# Altium schematic sheet HIVE_SIGHT_NUCLEO.SchDoc
size Tabloid; Sheet_Name: Insert name in Document Parameters; Size: 11x17
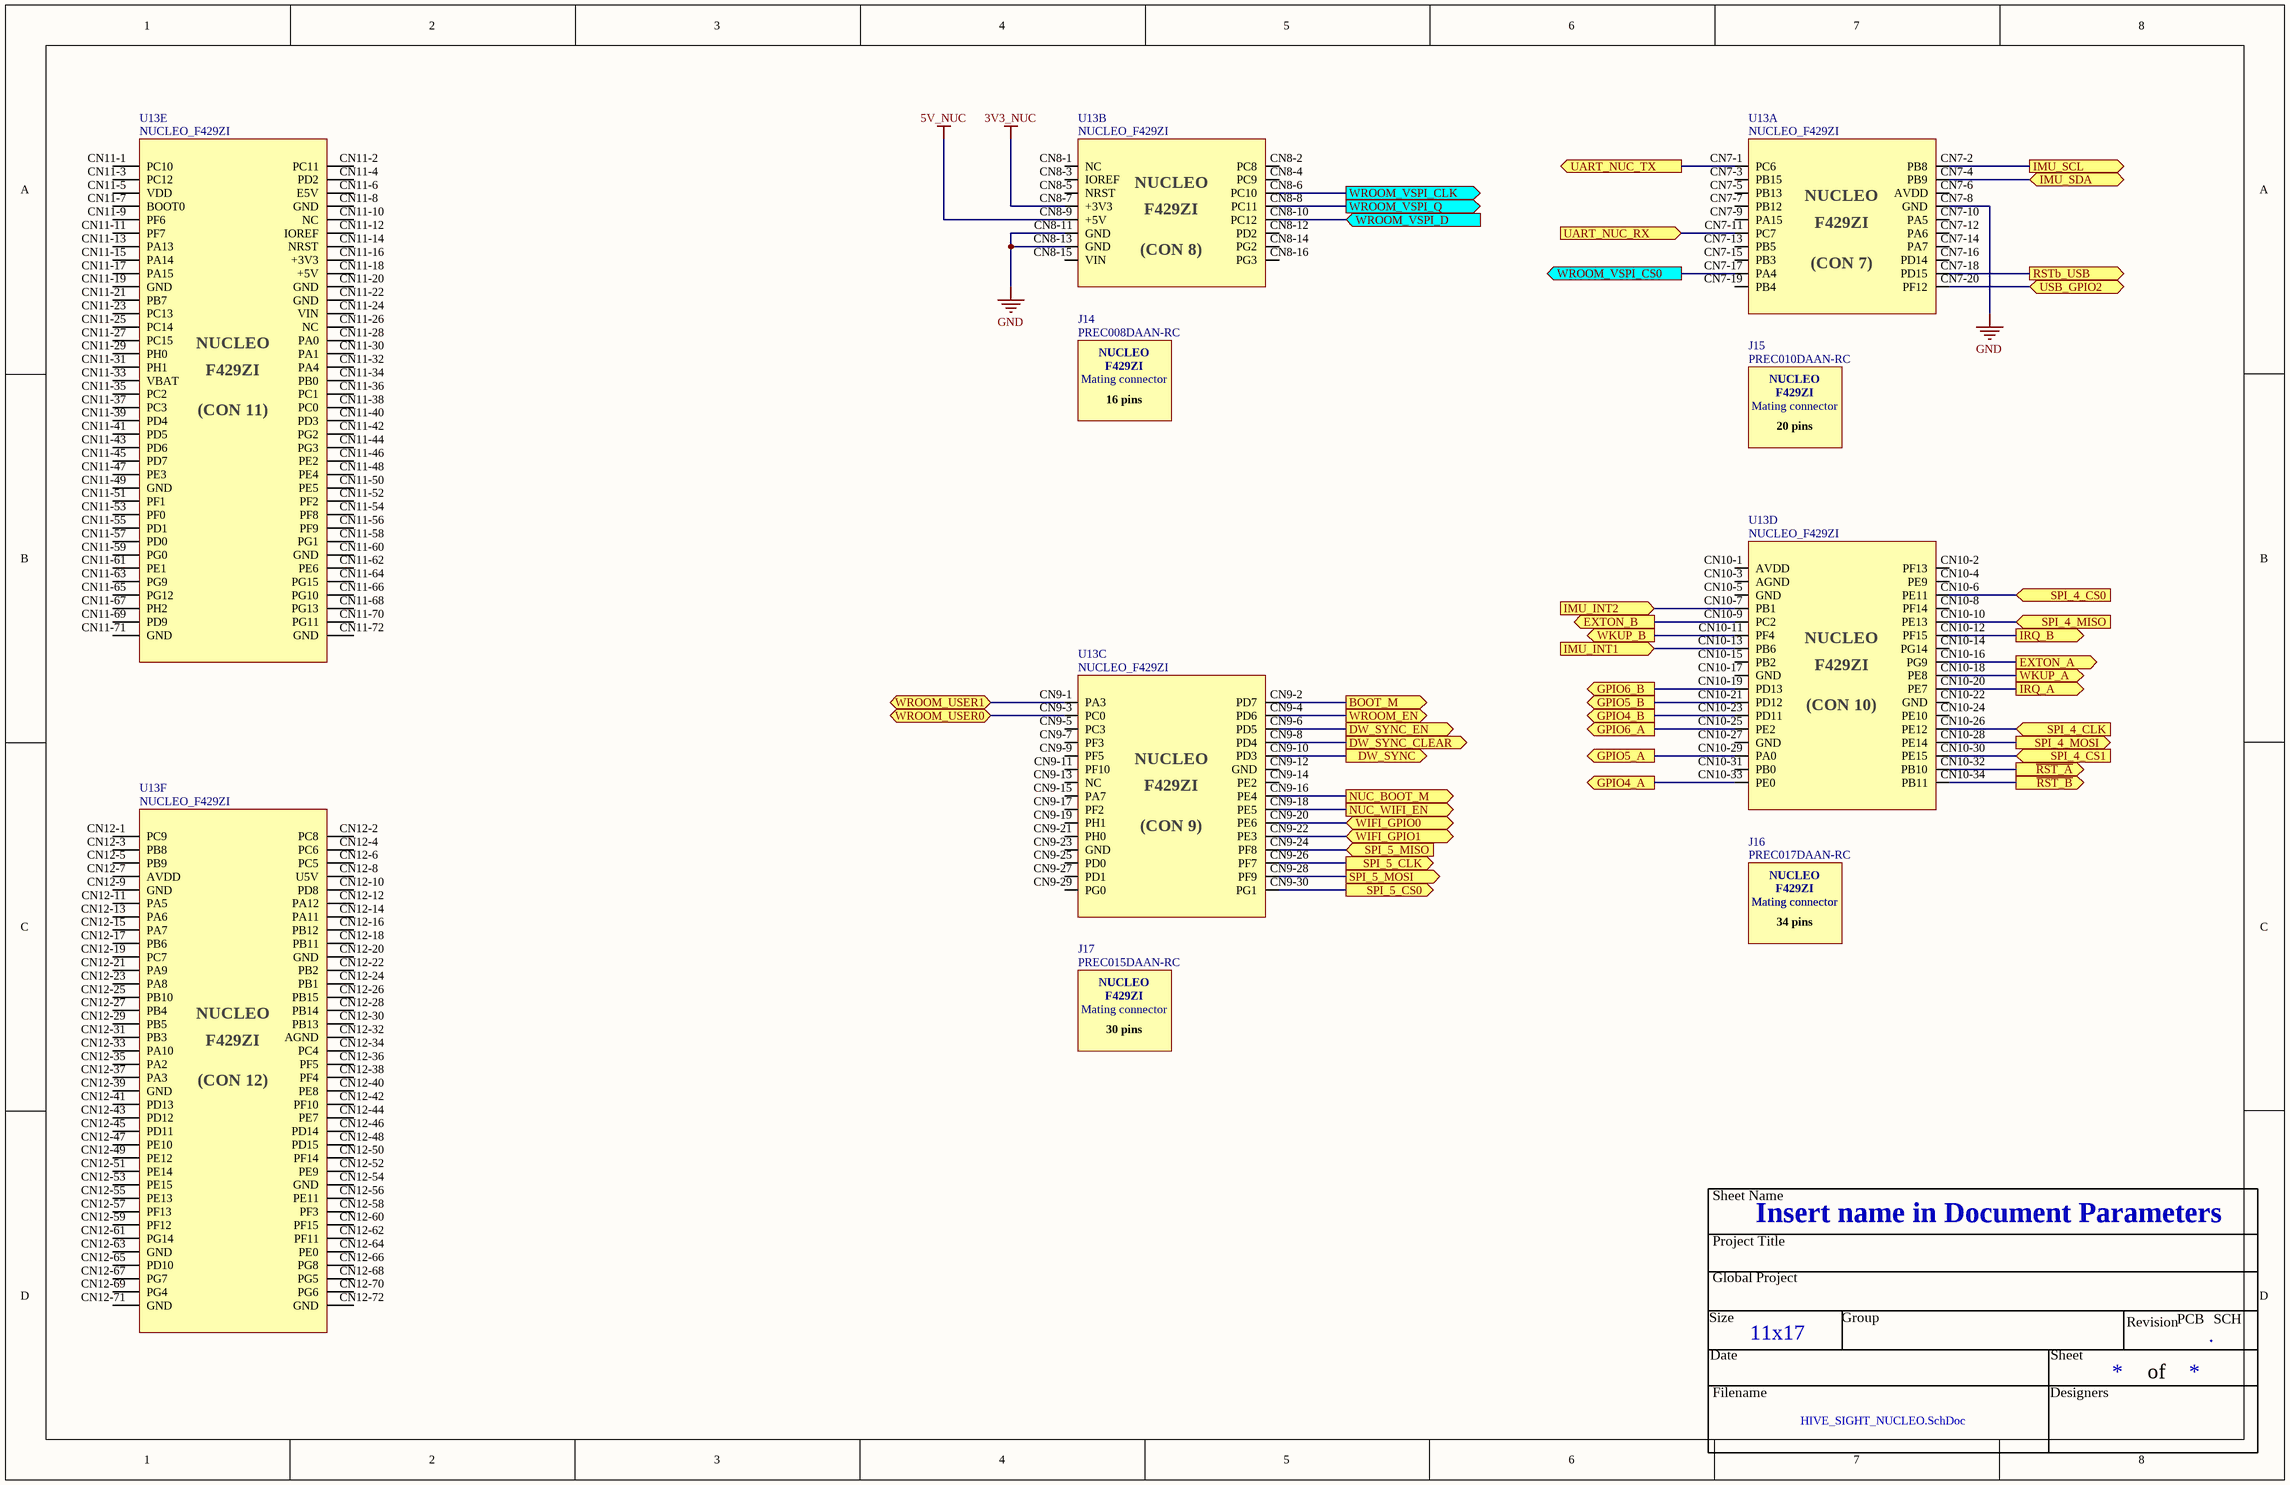
[diagram p0: HIVE_SIGHT_NUCLEO.SchDoc]

## Parts
J14  PREC008DAAN-RC  [CON_HDR_NUCLEO_F429ZI_C008DAAN-RC]
J15  PREC010DAAN-RC  [CON_HDR_NUCLEO_F429ZI_C010DAAN-RC]
J16  PREC017DAAN-RC  [CON_HDR_NUCLEO_F429ZI_C017DAAN-RC]
J17  PREC015DAAN-RC  [CON_HDR_NUCLEO_F429ZI_C015DAAN-RC]
U13  NUCLEO_F429ZI  [MOD_NUCLEO-F429ZI]  (parts A,B,C,D,E,F of 6)

## Ports
BOOT_M (out), DW_SYNC (out), DW_SYNC_CLEAR (out), DW_SYNC_EN (out), EXTON_A (out), EXTON_B (out), GPIO4_A (out), GPIO4_B (out), GPIO5_A (out), GPIO5_B (out), GPIO6_A (out), GPIO6_B (out), IMU_INT1 (in), IMU_INT2 (in), IMU_SCL (out), IMU_SDA (bidir), IRQ_A (out), IRQ_B (out), NUC_BOOT_M (out), NUC_WIFI_EN (out), RSTb_USB (out), SPI_4_CLK (in), SPI_4_CS0 (in), SPI_4_CS1 (in), SPI_4_MISO (in), SPI_4_MOSI (out), SPI_5_CLK (out), SPI_5_CS0 (out), SPI_5_MISO (in), SPI_5_MOSI (out), UART_NUC_RX (in), UART_NUC_TX (out), USB_GPIO2 (bidir), WIFI_GPIO0 (bidir), WIFI_GPIO1 (bidir), WKUP_A (out), WKUP_B (out), WROOM_EN (out), WROOM_USER0 (bidir), WROOM_USER1 (bidir), WROOM_VSPI_CLK (out), WROOM_VSPI_CS0 (out), WROOM_VSPI_D (in), WROOM_VSPI_Q (out), ~{RST_A} (out), ~{RST_B} (out)

## Nets
3V3_NUC: U13.CN8-7(+3V3)
5V_NUC: U13.CN8-9(+5V)
GND: U13.CN7-8(GND) U13.CN8-11(GND) U13.CN8-13(GND)
~{RST_A}: U13.CN10-32(PB10) ; port ~{RST_A}
~{RST_B}: U13.CN10-34(PB11) ; port ~{RST_B}
BOOT_M: U13.CN9-2(PD7) ; port BOOT_M
DW_SYNC: U13.CN9-10(PD3) ; port DW_SYNC
DW_SYNC_CLEAR: U13.CN9-8(PD4) ; port DW_SYNC_CLEAR
DW_SYNC_EN: U13.CN9-6(PD5) ; port DW_SYNC_EN
EXTON_A: U13.CN10-16(PG9) ; port EXTON_A
EXTON_B: U13.CN10-9(PC2) ; port EXTON_B
GPIO4_A: U13.CN10-33(PE0) ; port GPIO4_A
GPIO4_B: U13.CN10-23(PD11) ; port GPIO4_B
GPIO5_A: U13.CN10-29(PA0) ; port GPIO5_A
GPIO5_B: U13.CN10-21(PD12) ; port GPIO5_B
GPIO6_A: U13.CN10-25(PE2) ; port GPIO6_A
GPIO6_B: U13.CN10-19(PD13) ; port GPIO6_B
IMU_INT1: U13.CN10-13(PB6) ; port IMU_INT1
IMU_INT2: U13.CN10-7(PB1) ; port IMU_INT2
IMU_SCL: U13.CN7-2(PB8) ; port IMU_SCL
IMU_SDA: U13.CN7-4(PB9) ; port IMU_SDA
IRQ_A: U13.CN10-20(PE7) ; port IRQ_A
IRQ_B: U13.CN10-12(PF15) ; port IRQ_B
NUC_BOOT_M: U13.CN9-16(PE4) ; port NUC_BOOT_M
NUC_WIFI_EN: U13.CN9-18(PE5) ; port NUC_WIFI_EN
RSTb_USB: U13.CN7-18(PD15) ; port RSTb_USB
SPI_4_CLK: U13.CN10-26(PE12) ; port SPI_4_CLK
SPI_4_CS0: U13.CN10-6(PE11) ; port SPI_4_CS0
SPI_4_CS1: U13.CN10-30(PE15) ; port SPI_4_CS1
SPI_4_MISO: U13.CN10-10(PE13) ; port SPI_4_MISO
SPI_4_MOSI: U13.CN10-28(PE14) ; port SPI_4_MOSI
SPI_5_CLK: U13.CN9-26(PF7) ; port SPI_5_CLK
SPI_5_CS0: U13.CN9-30(PG1) ; port SPI_5_CS0
SPI_5_MISO: U13.CN9-24(PF8) ; port SPI_5_MISO
SPI_5_MOSI: U13.CN9-28(PF9) ; port SPI_5_MOSI
UART_NUC_RX: U13.CN7-11(PC7) ; port UART_NUC_RX
UART_NUC_TX: U13.CN7-1(PC6) ; port UART_NUC_TX
USB_GPIO2: U13.CN7-20(PF12) ; port USB_GPIO2
WIFI_GPIO0: U13.CN9-20(PE6) ; port WIFI_GPIO0
WIFI_GPIO1: U13.CN9-22(PE3) ; port WIFI_GPIO1
WKUP_A: U13.CN10-18(PE8) ; port WKUP_A
WKUP_B: U13.CN10-11(PF4) ; port WKUP_B
WROOM_EN: U13.CN9-4(PD6) ; port WROOM_EN
WROOM_USER0: U13.CN9-3(PC0) ; port WROOM_USER0
WROOM_USER1: U13.CN9-1(PA3) ; port WROOM_USER1
WROOM_VSPI_CLK: U13.CN8-6(PC10) ; port WROOM_VSPI_CLK
WROOM_VSPI_CS0: U13.CN7-17(PA4) ; port WROOM_VSPI_CS0
WROOM_VSPI_D: U13.CN8-10(PC12) ; port WROOM_VSPI_D
WROOM_VSPI_Q: U13.CN8-8(PC11) ; port WROOM_VSPI_Q

Not connected (* = marked no-connect by the designer): U13 CN7-3(PB15) CN7-5(PB13) CN7-6(AVDD) CN7-7(PB12) CN7-9(PA15) CN7-10(PA5) CN7-12(PA6) CN7-13(PB5) CN7-14(PA7) CN7-15(PB3) CN7-16(PD14) CN7-19(PB4) CN8-1(NC) CN8-2(PC8) CN8-3(IOREF) CN8-4(PC9) CN8-5(NRST) CN8-12(PD2) CN8-14(PG2) CN8-15(VIN) CN8-16(PG3) CN9-5(PC3) CN9-7(PF3) CN9-9(PF5) CN9-11(PF10) CN9-12(GND) CN9-13(NC) CN9-14(PE2) CN9-15(PA7) CN9-17(PF2) CN9-19(PH1) CN9-21(PH0) CN9-23(GND) CN9-25(PD0) CN9-27(PD1) CN9-29(PG0) CN10-1(AVDD) CN10-2(PF13) CN10-3(AGND) CN10-4(PE9) CN10-5(GND) CN10-8(PF14) CN10-14(PG14) CN10-15(PB2) CN10-17(GND) CN10-22(GND) CN10-24(PE10) CN10-27(GND) CN10-31(PB0) CN11-1(PC10) CN11-2(PC11) CN11-3(PC12) CN11-4(PD2) CN11-5(VDD) CN11-6(E5V) CN11-7(BOOT0) CN11-8(GND) CN11-9(PF6) CN11-10(NC) CN11-11(PF7) CN11-12(IOREF) CN11-13(PA13) CN11-14(NRST) CN11-15(PA14) CN11-16(+3V3) CN11-17(PA15) CN11-18(+5V) CN11-19(GND) CN11-20(GND) CN11-21(PB7) CN11-22(GND) CN11-23(PC13) CN11-24(VIN) CN11-25(PC14) CN11-26(NC) CN11-27(PC15) CN11-28(PA0) CN11-29(PH0) CN11-30(PA1) CN11-31(PH1) CN11-32(PA4) CN11-33(VBAT) CN11-34(PB0) CN11-35(PC2) CN11-36(PC1) CN11-37(PC3) CN11-38(PC0) CN11-39(PD4) CN11-40(PD3) CN11-41(PD5) CN11-42(PG2) CN11-43(PD6) CN11-44(PG3) CN11-45(PD7) CN11-46(PE2) CN11-47(PE3) CN11-48(PE4) CN11-49(GND) CN11-50(PE5) CN11-51(PF1) CN11-52(PF2) CN11-53(PF0) CN11-54(PF8) CN11-55(PD1) CN11-56(PF9) CN11-57(PD0) CN11-58(PG1) CN11-59(PG0) CN11-60(GND) CN11-61(PE1) CN11-62(PE6) CN11-63(PG9) CN11-64(PG15) CN11-65(PG12) CN11-66(PG10) CN11-67(PH2) CN11-68(PG13) CN11-69(PD9) CN11-70(PG11) CN11-71(GND) CN11-72(GND) CN12-1(PC9) CN12-2(PC8) CN12-3(PB8) CN12-4(PC6) CN12-5(PB9) CN12-6(PC5) CN12-7(AVDD) CN12-8(U5V) CN12-9(GND) CN12-10(PD8) CN12-11(PA5) CN12-12(PA12) CN12-13(PA6) CN12-14(PA11) CN12-15(PA7) CN12-16(PB12) CN12-17(PB6) CN12-18(PB11) CN12-19(PC7) CN12-20(GND) CN12-21(PA9) CN12-22(PB2) CN12-23(PA8) CN12-24(PB1) CN12-25(PB10) CN12-26(PB15) CN12-27(PB4) CN12-28(PB14) CN12-29(PB5) CN12-30(PB13) CN12-31(PB3) CN12-32(AGND) CN12-33(PA10) CN12-34(PC4) CN12-35(PA2) CN12-36(PF5) CN12-37(PA3) CN12-38(PF4) CN12-39(GND) CN12-40(PE8) CN12-41(PD13) CN12-42(PF10) CN12-43(PD12) CN12-44(PE7) CN12-45(PD11) CN12-46(PD14) CN12-47(PE10) CN12-48(PD15) CN12-49(PE12) CN12-50(PF14) CN12-51(PE14) CN12-52(PE9) CN12-53(PE15) CN12-54(GND) CN12-55(PE13) CN12-56(PE11) CN12-57(PF13) CN12-58(PF3) CN12-59(PF12) CN12-60(PF15) CN12-61(PG14) CN12-62(PF11) CN12-63(GND) CN12-64(PE0) CN12-65(PD10) CN12-66(PG8) CN12-67(PG7) CN12-68(PG5) CN12-69(PG4) CN12-70(PG6) CN12-71(GND) CN12-72(GND)

## Notes on the sheet
- Sheet Name
- Project Title
- Global Project
- Size
- Date
- Group
- Sheet
- Revision
- of
- PCB
- .
- SCH
- Filename
- Designers
- (in symbol CON_HDR_NUCLEO_F429ZI_PREC008DAAN-RC) NUCLEO; F429ZI; Mating connector; 16 pins
- (in symbol CON_HDR_NUCLEO_F429ZI_PREC010DAAN-RC) NUCLEO; F429ZI; Mating connector; 20 pins
- (in symbol CON_HDR_NUCLEO_F429ZI_PREC015DAAN-RC) NUCLEO; F429ZI; Mating connector; 30 pins
- (in symbol CON_HDR_NUCLEO_F429ZI_PREC017DAAN-RC) NUCLEO; F429ZI; Mating connector; 34 pins
- (in symbol MOD_NUCLEO_F429ZI, part A) NUCLEO; F429ZI; (CON 7)
- (in symbol MOD_NUCLEO_F429ZI, part B) NUCLEO; F429ZI; (CON 8)
- (in symbol MOD_NUCLEO_F429ZI, part C) NUCLEO; F429ZI; (CON 9)
- (in symbol MOD_NUCLEO_F429ZI, part D) NUCLEO; F429ZI; (CON 10)
- (in symbol MOD_NUCLEO_F429ZI, part E) NUCLEO; F429ZI; (CON 11)
- (in symbol MOD_NUCLEO_F429ZI, part F) NUCLEO; F429ZI; (CON 12)

## Library data of the parts
J14 = CON_HDR_NUCLEO_F429ZI_PREC008DAAN-RC: CON - Header 16 positions 2x8  0.100" - TH; Manufacturer #1: Sullins Connector Solutions; Current Rating: 3A; GRAMS Lib Spec: 2.8; Magnetic Material: Unknown; Polarized: No; Voltage Rating: 1000VAC; Assembly Type: TH; CreatedBy/Date: Louis-Daniel Gaulin / 21-10-2020; HelpURL: https://drawings-pdf.s3.amazonaws.com/11636.pdf; Manufacturer #2: *; Package: TH; Part Number #2: *; Power Max: *; Supplier 1: Digi-Key; Supplier Part Number 1: S2012EC-08-ND; Temperature: -55°C ~ 105°C; Tolerance: *; Value: *; Part Number #1: PREC008DAAN-RC; Cryo: UNKNOWN
J15 = CON_HDR_NUCLEO_F429ZI_PREC010DAAN-RC: CON - Header 20 positions 2x10  0.100" - TH; Manufacturer #1: Sullins Connector Solutions; Current Rating: 3A; GRAMS Lib Spec: 2.8; Magnetic Material: Unknown; Polarized: No; Voltage Rating: 1000VAC; Assembly Type: TH; CreatedBy/Date: Louis-Daniel Gaulin / 21-10-2020; HelpURL: https://drawings-pdf.s3.amazonaws.com/11636.pdf; Manufacturer #2: *; Package: TH; Part Number #2: *; Power Max: *; Supplier 1: Digi-Key; Supplier Part Number 1: S2012EC-10-ND; Temperature: -55°C ~ 105°C; Tolerance: *; Value: *; Part Number #1: PREC010DAAN-RC; Cryo: UNKNOWN
J16 = CON_HDR_NUCLEO_F429ZI_PREC017DAAN-RC: CON - Header 34 positions 2x17  0.100" - TH; Manufacturer #1: Sullins Connector Solutions; Current Rating: 3A; GRAMS Lib Spec: 2.8; Magnetic Material: Unknown; Polarized: No; Voltage Rating: 1000VAC; Assembly Type: TH; CreatedBy/Date: Louis-Daniel Gaulin / 21-10-2020; HelpURL: https://drawings-pdf.s3.amazonaws.com/11636.pdf; Manufacturer #2: *; Package: TH; Part Number #2: *; Power Max: *; Supplier 1: Digi-Key; Supplier Part Number 1: S2012EC-17-ND; Temperature: -55°C ~ 105°C; Tolerance: *; Value: *; Part Number #1: PREC017DAAN-RC; Cryo: UNKNOWN
J17 = CON_HDR_NUCLEO_F429ZI_PREC015DAAN-RC: CON - Header 30 positions 2x15  0.100" - TH; Manufacturer #1: Sullins Connector Solutions; Current Rating: 3A; GRAMS Lib Spec: 2.8; Magnetic Material: Unknown; Polarized: No; Voltage Rating: 1000VAC; Assembly Type: TH; CreatedBy/Date: Louis-Daniel Gaulin / 21-10-2020; HelpURL: https://drawings-pdf.s3.amazonaws.com/11636.pdf; Manufacturer #2: *; Package: TH; Part Number #2: *; Power Max: *; Supplier 1: Digi-Key; Supplier Part Number 1: S2012EC-15-ND; Temperature: -55°C ~ 105°C; Tolerance: *; Value: *; Part Number #1: PREC015DAAN-RC; Cryo: UNKNOWN
U13 = MOD_NUCLEO_F429ZI: MOD - F429ZI MCU Nucleo development board - MOD; Manufacturer #1: STMicroelectronics; Part Number #1: NUCLEO-F429ZI; Voltage Rating: 3V3 ~ 12V; Current Rating: 800mA; Power Max: 9.6W; GRAMS Lib Spec: 2.8c; Magnetic Material: Unknown; Polarized: Yes; Value: -; Tolerance: -; HelpURL: https://www.st.com/resource/en/user_manual/dm00244518-stm32-nucleo144-boards-mb1137-stmicroelectronics.pdf; CreatedBy/Date: Louis-Daniel Gaulin; Temperature: *; Package: *; Manufacturer #2: *; Note: *; Assembly Type: TH; Part Number #2: -; Supplier 1: Digi-Key; Supplier Part Number 1: 497-16280-ND; Parameter 1: -; Cryo: UNKNOWN